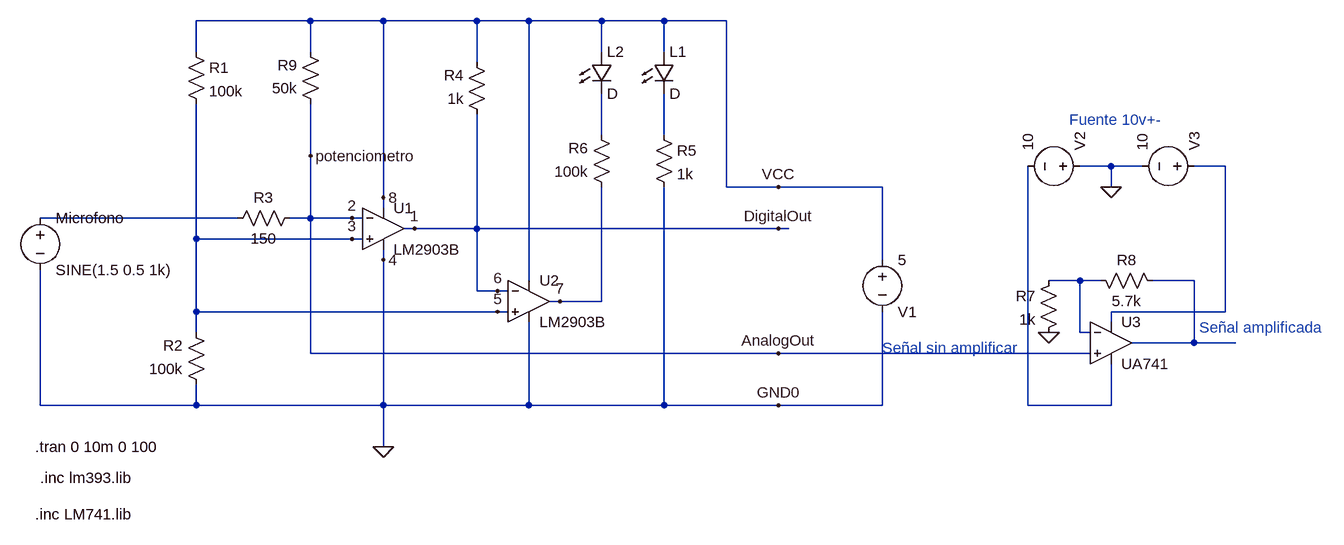
[diagram p0: schematic Proyecto 4 ltspice.asc]
Proyecto 4 ltspice.asc, the LTspice schematic file:
Version 4.1
SHEET 1 1588 744
WIRE -256 -304 -432 -304
WIRE -144 -304 -256 -304
WIRE 0 -304 -144 -304
WIRE 80 -304 0 -304
WIRE 192 -304 80 -304
WIRE 288 -304 192 -304
WIRE 384 -304 288 -304
WIRE -432 -256 -432 -304
WIRE -256 -256 -256 -304
WIRE 192 -256 192 -304
WIRE 288 -256 288 -304
WIRE 0 -240 0 -304
WIRE 192 -128 192 -192
WIRE 288 -128 288 -192
WIRE -256 -96 -256 -176
WIRE 976 -80 928 -80
WIRE 1024 -80 976 -80
WIRE 1152 -80 1104 -80
WIRE 384 -48 384 -304
WIRE 464 -48 384 -48
WIRE 624 -48 464 -48
WIRE 976 -48 976 -80
WIRE -144 -32 -144 -304
WIRE -144 -16 -144 -32
WIRE -368 0 -672 0
WIRE -256 0 -256 -96
WIRE -256 0 -288 0
WIRE -192 0 -256 0
WIRE -176 0 -192 0
WIRE -96 16 -112 16
WIRE 0 16 0 -160
WIRE 0 16 -96 16
WIRE 464 16 0 16
WIRE 480 16 464 16
WIRE -432 32 -432 -176
WIRE -192 32 -432 32
WIRE -176 32 -192 32
WIRE -144 64 -144 48
WIRE 624 64 624 -48
WIRE 80 96 80 -304
WIRE 928 96 880 96
WIRE 960 96 928 96
WIRE 1104 96 1040 96
WIRE 0 112 0 16
WIRE 32 112 0 112
WIRE 48 112 32 112
WIRE 128 128 112 128
WIRE 192 128 192 -48
WIRE 192 128 128 128
WIRE -432 144 -432 32
WIRE 32 144 -432 144
WIRE 48 144 32 144
WIRE 1152 144 1152 -80
WIRE 1152 144 976 144
WIRE 976 160 976 144
WIRE -432 176 -432 144
WIRE 928 176 928 96
WIRE 944 176 928 176
WIRE 1104 192 1104 96
WIRE 1104 192 1008 192
WIRE 1168 192 1104 192
WIRE -256 208 -256 0
WIRE 464 208 -256 208
WIRE 944 208 464 208
WIRE -672 288 -672 80
WIRE -432 288 -432 256
WIRE -432 288 -672 288
WIRE -144 288 -144 64
WIRE -144 288 -432 288
WIRE 80 288 80 160
WIRE 80 288 -144 288
WIRE 288 288 288 -48
WIRE 288 288 80 288
WIRE 464 288 288 288
WIRE 624 288 624 144
WIRE 624 288 464 288
WIRE 848 288 848 -80
WIRE 976 288 976 224
WIRE 976 288 848 288
WIRE -144 352 -144 288
FLAG 880 176 0
FLAG 464 -48 VCC
FLAG 464 16 DigitalOut
FLAG 464 208 AnalogOut
FLAG 464 288 GND0
FLAG -144 352 0
FLAG -144 -32 8
FLAG -144 64 4
FLAG -96 16 1
FLAG -192 0 2
FLAG -192 32 3
FLAG 32 112 6
FLAG 32 144 5
FLAG 128 128 7
FLAG -256 -96 potenciometro
FLAG 976 -48 0
SYMBOL res 16 -144 R180
WINDOW 0 36 76 Left 2
WINDOW 3 36 40 Left 2
SYMATTR InstName R4
SYMATTR Value 1k
SYMBOL Opamps\\opamp2 -144 -48 R0
SYMATTR InstName U1
SYMATTR Value LM2903B
SYMBOL Opamps\\opamp2 80 64 R0
SYMATTR InstName U2
SYMATTR Value LM2903B
SYMBOL voltage 624 48 R0
WINDOW 0 24 96 Left 2
WINDOW 3 24 16 Left 2
WINDOW 123 0 0 Left 2
WINDOW 39 0 0 Left 2
SYMATTR InstName V1
SYMATTR Value 5
SYMBOL res 208 -32 R180
WINDOW 0 36 76 Left 2
WINDOW 3 36 40 Left 2
SYMATTR InstName R6
SYMATTR Value 100k
SYMBOL res -416 272 R180
WINDOW 0 36 76 Left 2
WINDOW 3 36 40 Left 2
SYMATTR InstName R2
SYMATTR Value 100k
SYMBOL res -448 -272 R0
SYMATTR InstName R1
SYMATTR Value 100k
SYMBOL res 272 -144 R0
SYMATTR InstName R5
SYMATTR Value 1k
SYMBOL res -272 -16 R90
WINDOW 0 0 56 VBottom 2
WINDOW 3 32 56 VTop 2
SYMATTR InstName R3
SYMATTR Value 150
SYMBOL res 896 80 M0
SYMATTR InstName R7
SYMATTR Value 1k
SYMBOL res 944 80 M90
WINDOW 0 0 56 VBottom 2
WINDOW 3 32 56 VTop 2
SYMATTR InstName R8
SYMATTR Value 5.7k
SYMBOL res -240 -160 R180
WINDOW 0 36 76 Left 2
WINDOW 3 36 40 Left 2
SYMATTR InstName R9
SYMATTR Value 50k
SYMBOL voltage 944 -80 M270
WINDOW 123 0 0 Left 2
WINDOW 39 0 0 Left 2
SYMATTR InstName V2
SYMATTR Value 10
SYMBOL voltage -672 -16 R0
WINDOW 123 0 0 Left 0
WINDOW 39 0 0 Left 0
SYMATTR InstName Microfono
SYMATTR Value SINE(1.5 0.5 1k)
SYMBOL LED 272 -256 R0
SYMATTR InstName L1
SYMBOL LED 176 -256 R0
SYMATTR InstName L2
SYMBOL Opamps\\opamp2 976 128 R0
SYMATTR InstName U3
SYMATTR Value UA741
SYMBOL voltage 1120 -80 M270
WINDOW 123 0 0 Left 2
WINDOW 39 0 0 Left 2
SYMATTR InstName V3
SYMATTR Value 10
TEXT -672 400 Left 2 !.inc lm393.lib
TEXT -680 352 Left 2 !.tran 0 10m 0 100
TEXT -680 456 Left 2 !.inc LM741.lib
TEXT 624 200 Left 2 ;Señal sin amplificar
TEXT 1112 168 Left 2 ;Señal amplificada
TEXT 912 -152 Left 2 ;Fuente 10v+-

The netlist it stands for:
* Proyecto 4 ltspice.asc
R4 6 8 1k
X§U1 5 potenciometro 8 0 6 LM2903B  ; pins In+ In- V+ V- OUT
X§U2 5 6 8 0 7 LM2903B  ; pins In+ In- V+ V- OUT
V1 8 0 5
R6 7 N001 100k
R2 0 5 100k
R1 8 5 100k
R5 N002 0 1k
R3 potenciometro N004 150
R7 N005 0 1k
R8 N005 N006 5.7k
R9 potenciometro 8 50k
V2 0 N007 10
V§Microfono N004 0 SINE(1.5 0.5 1k)
D§L1 8 N002 D
D§L2 8 N001 D
X§U3 potenciometro N005 N003 N007 N006 UA741  ; pins In+ In- V+ V- OUT
V3 N003 0 10
.model D D
.lib standard.dio
.inc lm393.lib
.tran 0 10m 0 100
.inc LM741.lib
* Señal sin amplificar
* Señal amplificada
* Fuente 10v+-
.backanno
.end